# Altium schematic sheet Top.SchDoc
size A4
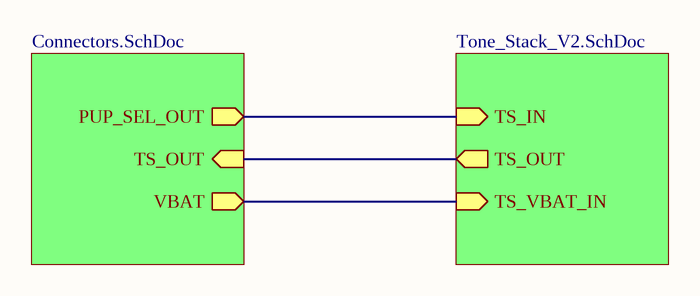
[diagram p0: Top.SchDoc]

## Sub-sheets
Designator = Connectors.SchDoc: PUP_SEL_OUT (out), TS_OUT (in), VBAT (out)
Designator = Tone_Stack_V2.SchDoc: TS_IN (in), TS_OUT (out), TS_VBAT_IN (in)

## Nets
(unnamed): sheet Designator/PUP_SEL_OUT, sheet Designator/TS_IN
(unnamed): sheet Designator/TS_OUT, sheet Designator/TS_OUT
(unnamed): sheet Designator/VBAT, sheet Designator/TS_VBAT_IN